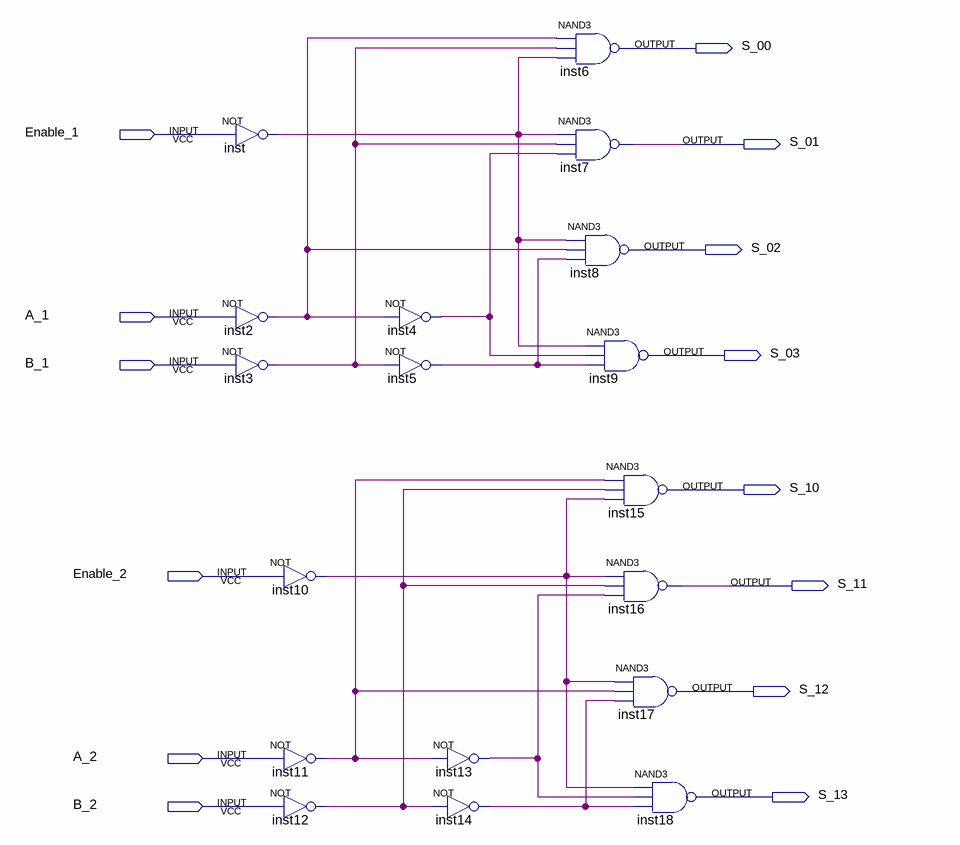
[diagram p0: schematic sheet]
// Quartus schematic DM74LS139.bdf as structural Verilog: 18 symbols, 14 pins
module DM74LS139 (
  input  Enable_1,
  input  A_1,
  input  B_1,
  input  Enable_2,
  input  A_2,
  input  B_2,
  output S_00,
  output S_01,
  output S_02,
  output S_03,
  output S_10,
  output S_11,
  output S_12,
  output S_13
);

  wire inst2_out, inst3_out, inst4_out, inst5_out, inst10_out, inst11_out, inst12_out, inst13_out,
       inst14_out, inst_out;

  not inst (inst_out, Enable_1);
  not inst2 (inst2_out, A_1);
  not inst3 (inst3_out, B_1);
  not inst10 (inst10_out, Enable_2);
  not inst11 (inst11_out, A_2);
  not inst12 (inst12_out, B_2);
  not inst4 (inst4_out, inst2_out);
  not inst5 (inst5_out, inst3_out);
  not inst13 (inst13_out, inst11_out);
  not inst14 (inst14_out, inst12_out);
  nand inst6 (S_00, inst2_out, inst3_out, inst_out);
  nand inst7 (S_01, inst_out, inst3_out, inst4_out);
  nand inst8 (S_02, inst_out, inst2_out, inst5_out);
  nand inst9 (S_03, inst_out, inst4_out, inst5_out);
  nand inst15 (S_10, inst11_out, inst12_out, inst10_out);
  nand inst16 (S_11, inst10_out, inst12_out, inst13_out);
  nand inst17 (S_12, inst10_out, inst11_out, inst14_out);
  nand inst18 (S_13, inst10_out, inst13_out, inst14_out);
endmodule
